# Altium project DVT-Buffer.PrjPcb
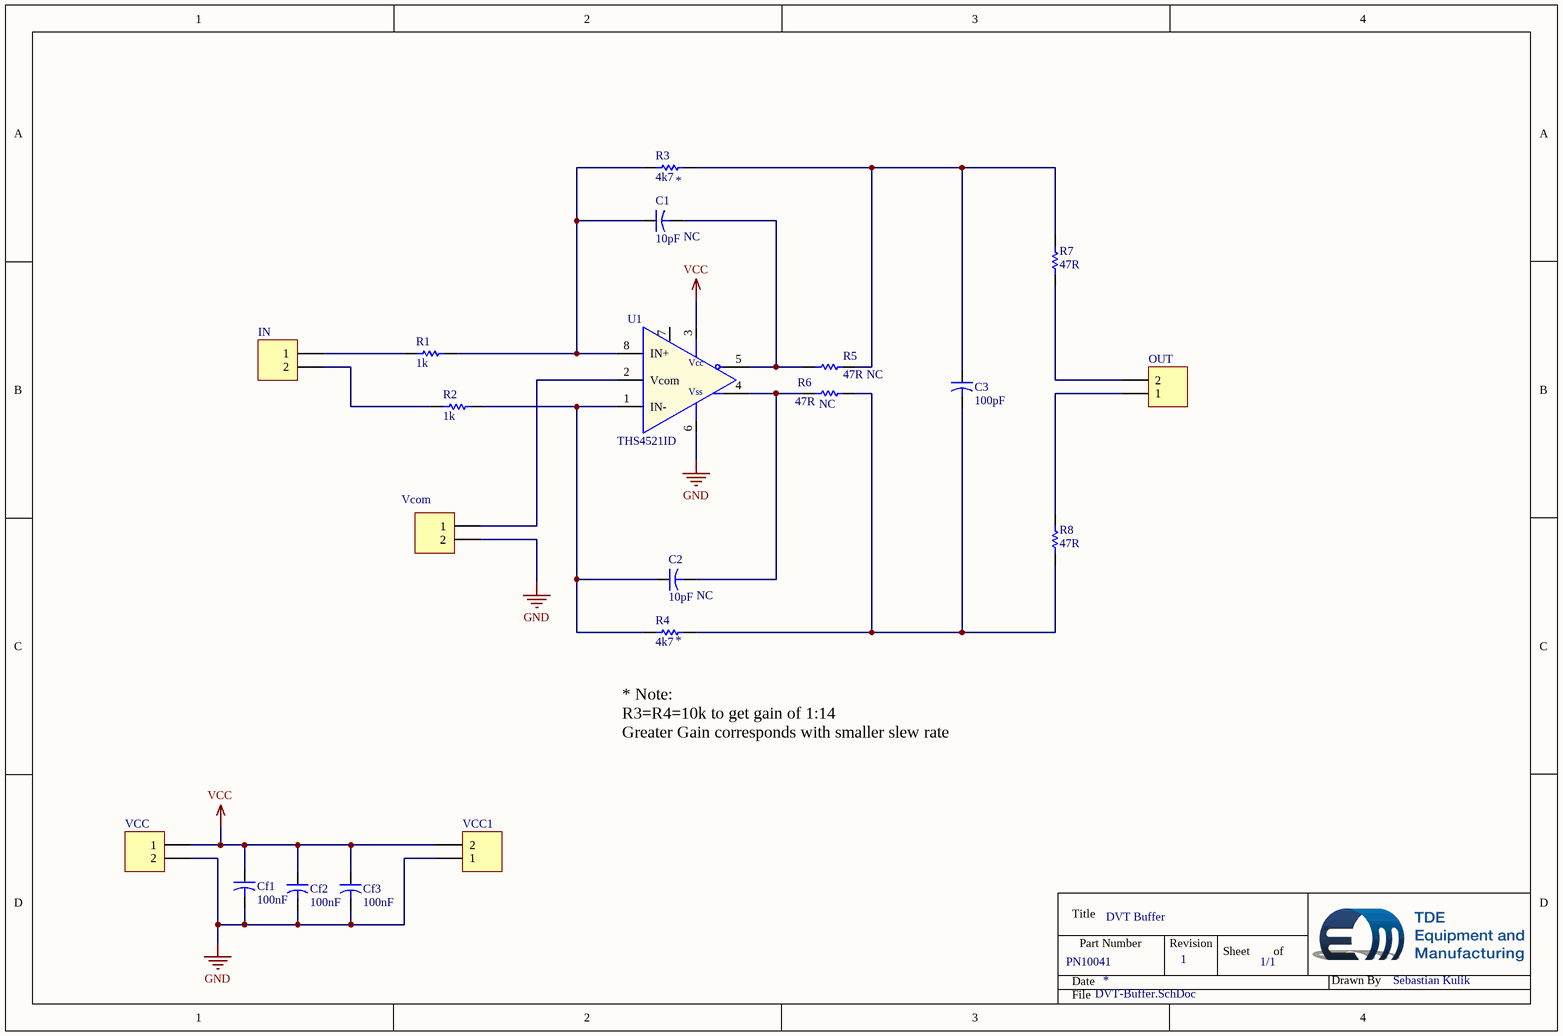
[diagram p0: DVT-Buffer.SchDoc]
1 sheet, 20 parts. Net scope: global (net labels, ports and power ports of the same name join across sheets).
Board file: DVT-Buffer.PcbDoc

## Sheet DVT-Buffer.SchDoc: DVT Buffer
size A4; SheetNumber: 1; SheetTotal: 1; PartNumber: PN10041; Drawn By: Sebastian Kulik

### Parts
C1  value 10pF  [Dummy-10mm]  (hidden comment: Capacitor-Dummy-THT)
C2  value 10pF  [Dummy-10mm]  (hidden comment: Capacitor-Dummy-THT)
C3  value 100pF  [Dummy-10mm]  (hidden comment: Capacitor-Dummy-THT)
Cf1  value 100nF  [Dummy-10mm]  (hidden comment: Capacitor-Dummy-THT)
Cf2  value 100nF  [Dummy-10mm]  (hidden comment: Capacitor-Dummy-THT)
Cf3  value 100nF  [Dummy-10mm]  (hidden comment: Capacitor-Dummy-THT)
IN  PHOENIX_1715721  [Phoenix-2-5_08]  (value not drawn)
OUT  PHOENIX_1715721  [Phoenix-2-5_08]  (value not drawn)
R1  value 1k  [Dummy-10mm]  (hidden comment: Resistor-Dummy-THT)
R2  value 1k  [Dummy-10mm]  (hidden comment: Resistor-Dummy-THT)
R3  value 4k7  [Dummy-10mm]  (hidden comment: Resistor-Dummy-THT)
R4  value 4k7  [Dummy-10mm]  (hidden comment: Resistor-Dummy-THT)
R5  value 47R  [Dummy-10mm]  (hidden comment: Resistor-Dummy-THT)
R6  value 47R  [Dummy-10mm]  (hidden comment: Resistor-Dummy-THT)
R7  value 47R  [Dummy-10mm]  (hidden comment: Resistor-Dummy-THT)
R8  value 47R  [Dummy-10mm]  (hidden comment: Resistor-Dummy-THT)
U1  THS4521ID  [TSSOP8]
VCC  PHOENIX_1715721  [Phoenix-2-5_08]  (value not drawn)
VCC1  PHOENIX_1715721  [Phoenix-2-5_08]  (value not drawn)
Vcom  Plug_2_90_2.54  [HDR1X2]  (value not drawn)

### Nets
GND: Cf1.2 Cf2.2 Cf3.2 U1.6(Vss) VCC.2 VCC1.1 Vcom.2
VCC: Cf1.1 Cf2.1 Cf3.1 U1.3(Vcc) VCC.1 VCC1.2
NetC1_1: C1.1 R1.2 R3.1 U1.8(IN+)
NetC1_2: C1.2 R5.1 U1.5(OUT+)
NetC2_1: C2.1 R2.2 R4.1 U1.1(IN-)
NetC2_2: C2.2 R6.1 U1.4(OUT-)
NetC3_1: C3.1 R3.2 R5.2 R7.2
NetC3_2: C3.2 R4.2 R6.2 R8.1
NetIN_1: IN.1 R1.1
NetIN_2: IN.2 R2.1
NetOUT_1: OUT.1 R8.2
NetOUT_2: OUT.2 R7.1
NetU1_2: U1.2(Vcom) Vcom.1

Not connected (* = marked no-connect by the designer): U1 7(PD)

### Notes on the sheet
- (near R3) *
- (near C1) NC
- NC
- (near R6) NC
- (near R4) *
- (near C2) NC
- (near R4) * Note:
  R3=R4=10k to get gain of 1:14
  Greater Gain corresponds with smaller slew rate
- 1
- 1/1
- Title
- Date
- Part Number
- Revision
- Sheet
- of
- Drawn By
- File

### Library data of the parts
C1 C2 = Capacitor-Dummy-THT: Deliverer PartNr: 538-1146; Deliverer: RS; Published: 08.12.2015; Part Description: Capacitor-Dummy-THT; Publisher: Sebastian Kulik; PackageDescription: -; Manufacturer: -; Manufacturer PartNr: -; TDE-PN: -; Price: 0.27/5
C3 = Capacitor-Dummy-THT: Deliverer PartNr: 538-1376; Deliverer: RS; Published: 08.12.2015; Part Description: Capacitor-Dummy-THT; Publisher: Sebastian Kulik; PackageDescription: -; Manufacturer: -; Manufacturer PartNr: -; TDE-PN: -; Price: 0.238/5
Cf1-Cf3 = Capacitor-Dummy-THT: Deliverer PartNr: 537-3707; Deliverer: RS; Published: 08.12.2015; Part Description: Capacitor-Dummy-THT; Publisher: Sebastian Kulik; PackageDescription: -; Manufacturer: -; Manufacturer PartNr: -; TDE-PN: -; Price: 0.156/25
IN OUT VCC VCC1 = 2Pol_1715721: Phoenix, 2 pol, 5.08mm, 22A, 715721; Deliverer PartNr: 193-0564; Deliverer: RS; TDE-PN: CON0008; LatestRevisionDate: 02.05.2014; LatestRevisionNote: Re-released for DXP Platform.; Publisher: Sebastian Kulik; Manufacturer PartNr: 1715721; Manufacturer: Phoenix; PackageDescription: Phoenix-2-5_08
  IN OUT: Price: 0.976/5
R1 R2 = Resistor-Dummy-THT: Deliverer PartNr: 148-506; Deliverer: RS; Published: 08.12.2015; Publisher: Sebastian Kulik; PackageDescription: -; Manufacturer: -; Manufacturer PartNr: -; TDE-PN: -; Part Desicription: Resistor-Dummy-THT; Price: 0.027/10
R3 R4 = Resistor-Dummy-THT: Deliverer PartNr: 148-663; Deliverer: RS; Published: 08.12.2015; Publisher: Sebastian Kulik; PackageDescription: -; Manufacturer: -; Manufacturer PartNr: -; TDE-PN: -; Part Desicription: Resistor-Dummy-THT; Price: 0.046/10
R5-R8 = Resistor-Dummy-THT: Deliverer PartNr: 148-736; Deliverer: RS; Published: 08.12.2015; Publisher: Sebastian Kulik; PackageDescription: -; Manufacturer: -; Manufacturer PartNr: -; TDE-PN: -; Part Desicription: Resistor-Dummy-THT; Price: 0.027/10
U1 = THS4521ID: Fully differential OP, 50MHz; Deliverer PartNr: 709-2867; Manufacturer: TI; Deliverer: RS; TDE-PN: IC00073; Published: 15.04.2016; PackageDescription: TSSOP8; Publisher: Sebastian Kulik; Manufacturer PartNr: THS4521ID; Price: 3.29
Vcom = Plug_2_90_2.54: Plug, 2-Pin; Manufacturer PartNr: 61300211021; Manufacturer: WE; Deliverer PartNr: 828-1651; Deliverer: RS; TDE-PN: CON0010; LatestRevisionDate: 14.05.2014; LatestRevisionNote: Re-released for DXP Platform.; Publisher: Sebastian Kulik; Price: 0.306/5